# EAGLE design usb2lds_v1.0 (EAGLE 6.5.0)
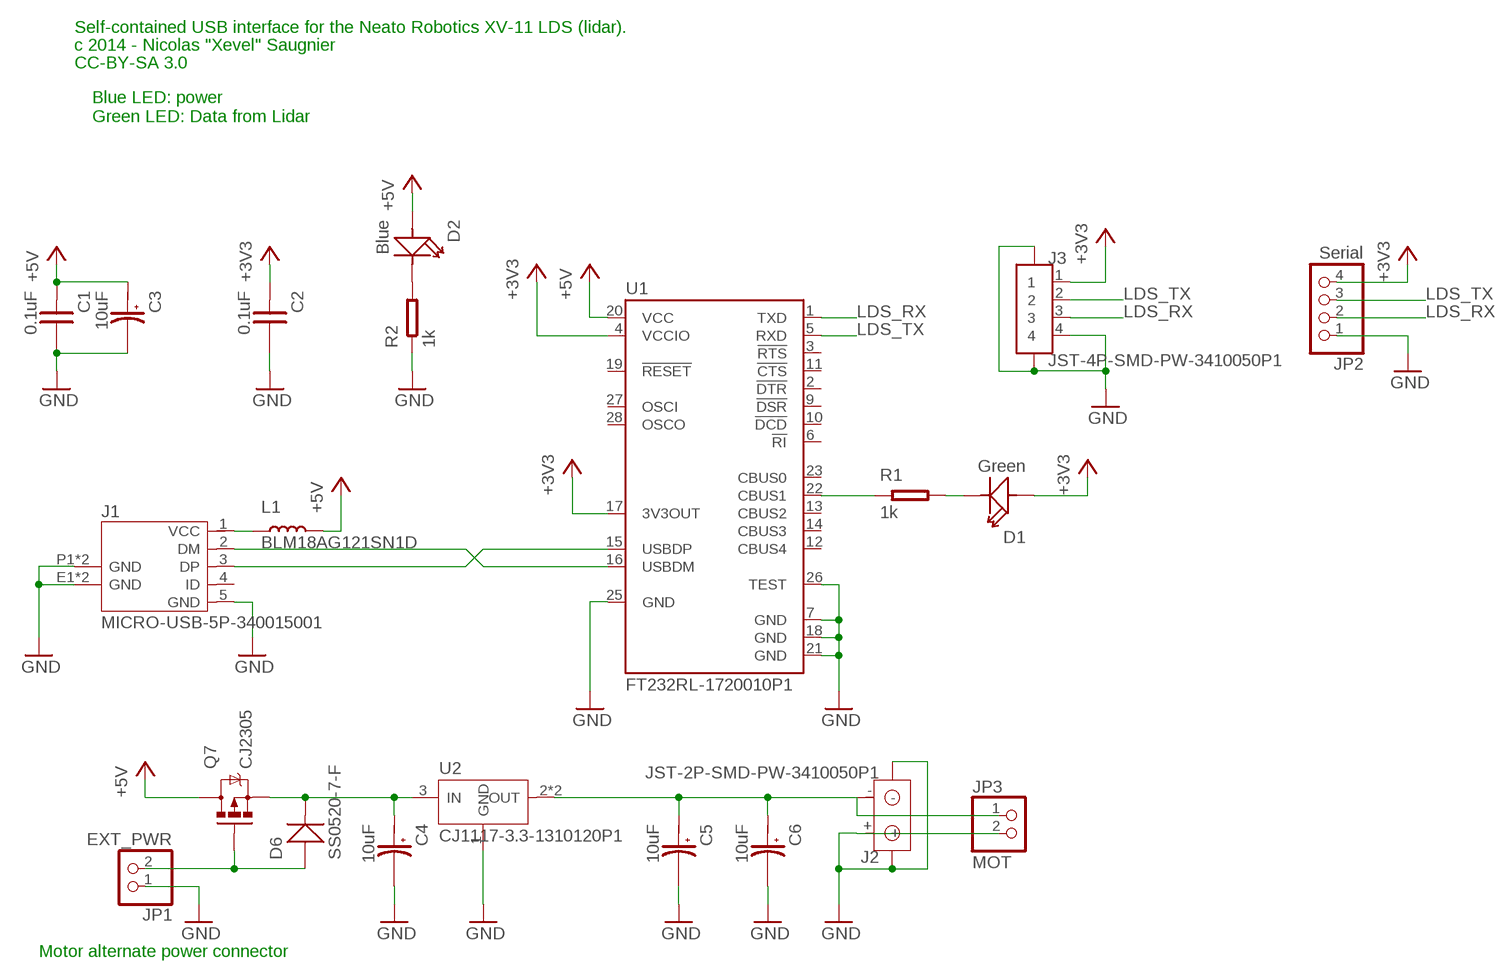
[diagram p0: schematic, sheet 1]

## Parts
C1  0.1uF  C-0603  [C0603]
C2  0.1uF  C-0603  [C0603]
C3  10uF  C-POLAR-A  [AVX-A]
C4  10uF  C-POLAR-A  [AVX-A]
C5  10uF  C-POLAR-A  [AVX-A]
C6  10uF  C-POLAR-A  [AVX-A]
D1  Green  LED  [LED0603]
D2  Blue  LED  [LED0603]
D6  SS0520-7-F  D-SOD-123  [SOD123]
J1  MICRO-USB-5P-340015001  [B-SMD-5P]
J2  JST-2P-SMD-PW-3410050P1  [2P-SMD-2.0-90D]
J3  JST-4P-SMD-PW-3410050P1  [CON-4P-SMD-2.0-90D]
JP1  EXT_PWR  PINHD-1X2  [1X02]
JP2  Serial  PINHD-1X4  [1X04]
JP3  MOT  PINHD-1X2  [1X02]
L1  BLM18AG121SN1D  L-0603  [L0603]
Q7  CJ2305  MOSFET_P_FDN308P  [SOT-23-3_N/SSOT-3_N]
R1  1k  R-0603  [R0603]
R2  1k  R-0603  [R0603]
U1  FT232RL-1720010P1  [SSOP28]
U2  CJ1117-3.3-1310120P1  [SOT89]

## Nets
+3V3: C2.1 D1.+ J3.1 JP2.4 U1.4(VCCIO) U1.17(3V3OUT)
+5V: C1.1 C3.+ D2.+ L1.2 Q7.3(D) U1.20(VCC)
GND: C1.2 C2.2 C3.- C4.- C5.- C6.- J1.5(GND) J1.E1(GND) J1.E2(GND) J1.P1(GND) J1.P2(GND) J2.3 J2.4 J2.+ J3.4 J3.5 J3.6 JP1.1 JP2.1 JP3.2 R2.1 U1.7(GND) U1.18(GND) U1.21(GND) U1.25(GND) U1.26(TEST) U2.1(GND)
LDS_RX: J3.3 JP2.2 U1.1(TXD)
LDS_TX: J3.2 JP2.3 U1.5(RXD)
N$1: J1.2(DM) U1.16(USBDM)
N$2: J1.3(DP) U1.15(USBDP)
N$3: J1.1(VCC) L1.1
N$6: D1.- R1.2
N$7: D2.- R2.2
N$8: R1.1 U1.22(CBUS1)
N$9: C5.+ C6.+ J2.- JP3.1 U2.2(OUT) U2.4(OUT)
N$11: C4.+ D6.- Q7.2(S) U2.3(IN)
VUSB: D6.+ JP1.2 Q7.1(G)
Unconnected: J1.4(ID) U1.2(!DTR) U1.3(!RTS) U1.6(!RI) U1.9(!DSR) U1.10(!DCD) U1.11(!CTS) U1.12(CBUS4) U1.13(CBUS2) U1.14(CBUS3) U1.19(!RESET) U1.23(CBUS0) U1.27(OSCI) U1.28(OSCO)

## Notes on the sheet
- Self-contained USB interface for the Neato Robotics XV-11 LDS (lidar).
- c 2014 - Nicolas "Xevel" Saugnier
- CC-BY-SA 3.0
- Blue LED: power
  Green LED: Data from Lidar
- Motor alternate power connector

## Library data of the parts
C1 C2 = OPL:C*
C3-C6 = OPL:C-POLAR*
D1 D2 = OPL:LED*: LED
D6 = OPL:D*: DIODE
J1 = OPL:MICRO-USB-5P: ST-USB-001E：MICRO USB B SMD R/A
J2 = OPL:JST-2P-SMD-PW
J3 = Xevelabs:JST-4P-SMD-PW
JP1 JP3 = pinhead:PINHD-1X2: PIN HEADER
JP2 = pinhead:PINHD-1X4: PIN HEADER
L1 = OPL:L*
Q7 = Xevelabs:MOSFET_P
R1 R2 = OPL:R*
U1 = OPL:FT232RL: USB UART IC Source: http://www.ftdichip.com/Documents/DataSheets/DS_FT232R_v104.pdf
U2 = OPL:CJ1117-3.3: 1A Low Dropout Linear Regulator

## Board
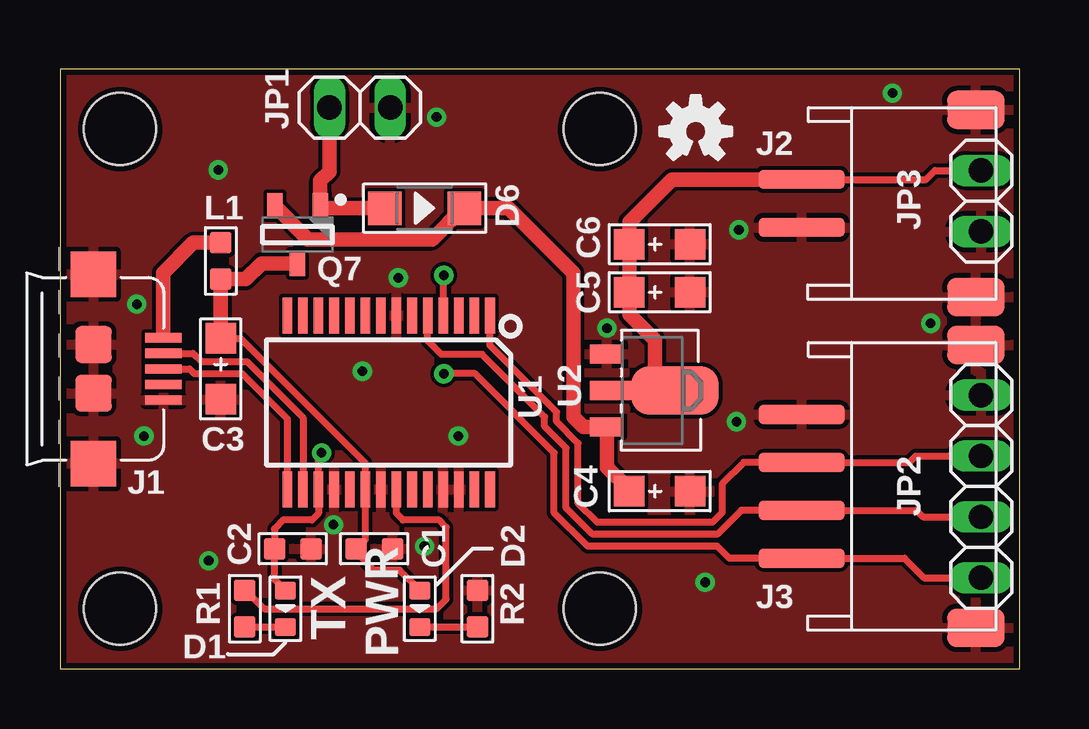
[diagram p1: board, top side]
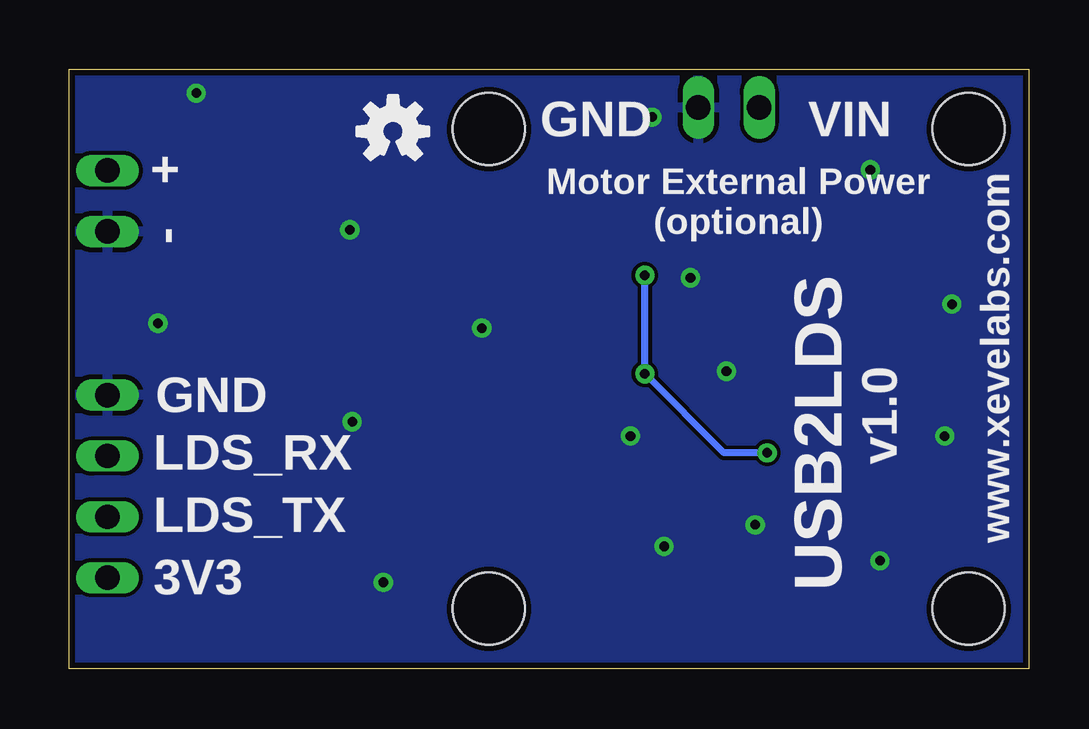
[diagram p2: board, bottom side, seen from below]

Size 40 x 25 mm. Coordinates in mm from the lower left corner, seen from the top.
Outline: 0,0 40,0 40,25 0,25 0,0
Copper layers (1*16): Top 0.035mm / dielectric 1.55mm / Bottom 0.035mm
Design rules "Xevelabs_6mil_eurocircuits": minimum track width 0.15mm, minimum drill 0.25mm, track to track 0.155mm, track to pad 0.155mm, pad to pad 0.155mm, via to via 0.155mm, smd to smd 0mil, copper to edge 0.25mm, drill to drill 0.25mm, minimum pad ring 0mil, minimum via ring 0.2mm, stop-mask expansion 0mil, vias tented up to drill 100mil, thermal gap 0.2mm
Holes 3 mm at 2.5,2.5 2.5,22.5 22.5,22.5 22.5,2.5

### Footprints (pad centres in the part's own frame; a part is rotated, then mirrored left to right if it is on the bottom)
C0603 = smd 0.889 x 0.889: 1 -0.762,0; 2 0.762,0
AVX-A = smd 1.27 x 1.27: + -1.27,0; - 1.27,0
LED0603 = smd 0.762 x 0.889: + -0.762,0; - 0.762,0
SOD123 = smd 1.397 x 1.397: + -1.651,0; - 1.651,0
B-SMD-5P = smd 0.38 x 1.52: 1 -1.3,2.921; 2 -0.65,2.921; 3 0,2.921; 4 0.65,2.921; 5 1.3,2.921 | smd 1.524 x 1.524: E1 -1.016,0; E2 1.016,0 | smd 1.9 x 1.9: P1 -3.95,0; P2 3.95,0
2P-SMD-2.0-90D = smd 1.6 x 2.4: 3 3.9,-2.181; 4 -3.9,-2.181 | smd 0.8 x 3.6: + -1,5.08; - 1,5.08
CON-4P-SMD-2.0-90D = smd 0.8 x 3.6: 1 -3,5.08; 2 -1,5.08; 3 1,5.08; 4 3,5.08 | smd 1.6 x 2.4: 5 -5.9,-2.181; 6 5.9,-2.181
1X02 = drill 1.016 long: 1 -1.27,0; 2 1.27,0
1X04 = drill 1.016 long: 1 -3.81,0; 2 -1.27,0; 3 1.27,0; 4 3.81,0
L0603 = smd 0.889 x 0.889: 1 -0.762,0; 2 0.762,0
SOT-23-3_N/SSOT-3_N = smd 1.05 x 0.65: 1 -1.2,0.95; 2 -1.2,-0.95; 3 1.2,0
R0603 = smd 0.889 x 0.889: 1 -0.762,0; 2 0.762,0
SSOP28 = smd 1.5 x 0.4: 1 -3.625,4.225; 2 -3.625,3.575; 3 -3.625,2.925; 4 -3.625,2.275; 5 -3.625,1.625; 6 -3.625,0.975; 7 -3.625,0.325; 8 -3.625,-0.325; 9 -3.625,-0.975; 10 -3.625,-1.625; 11 -3.625,-2.275; 12 -3.625,-2.925; 13 -3.625,-3.575; 14 -3.625,-4.225; 15 3.625,-4.225; 16 3.625,-3.575; 17 3.625,-2.925; 18 3.625,-2.275; 19 3.625,-1.625; 20 3.625,-0.975; 21 3.625,-0.325; 22 3.625,0.325; 23 3.625,0.975; 24 3.625,1.625; 25 3.625,2.275; 26 3.625,2.925; 27 3.625,3.575; 28 3.625,4.225
SOT89 = smd 0.8 x 1.4: 1 -1.524,-1.905; 3 1.524,-1.905 | smd 0.8 x 1.9: 2 0,-1.651 | smd 2.032 x 3.65: 4 0,0.94

### Placement (x,y rotation side)
C1  13.1,5 0 top
C2  9.7,5 0 top
C3  6.7,12.5 270 top
C4  25,7.4 0 top
C5  25,15.7 0 top
C6  25,17.7 0 top
D1  9.4,2.5 270 top
D2  15,2.5 270 top
D6  15.2,19.2 0 top
J1  1.4,12.5 270 top
J2  36,19.4 90 top
J3  36,7.6 90 top
JP1  12.5,23.4 180 top
JP2  38.4,7.6 270 top
JP3  38.4,19.5 270 top
L1  6.7,17 270 top
Q7  9.9,18.1 270 top
R1  7.7,2.5 270 top
R2  17.4,2.5 270 top
U1  13.7,11.1 270 top
U2  24.7,11.6 270 top
U$1  [OSHW-LOGO-S]  26.5,22.4 0 top
U$2  [OSHW-LOGO-S]  26.5,22.4 0 bottom

### Tracks (layer width: path | path; a pad name or v marks a point on that pad's centre or on a via)
+3V3  (via drill 0.4)
  Top 0.3: JP2.4 36.01,3.79 35.2,4.6 J3.1 27.9,4.6 27.4,5.1 22,5.1 20.6,6.5 20.6,9 17.3,12.3 v16,12.3 | v16,16.4 15.97,16.38 U1.4 | v10.9,9 10.78,8.88 U1.17 10.78,6.47 10.5,6.2 9.3,6.2 8.94,5.84 C2.1 8.94,3.72 D1.+
  Bottom 0.3: v16,16.4 v16,12.3 12.7,9 v10.9,9
+5V
  Top 0.3: C3.+ 7.53,13.77 12.72,8.57 U1.20 12.72,5.39 C1.1 12.34,4.86 13.1,4.1 14.16,4.1 D2.+
  Top 0.6: C3.+ L1.2 7.74,16.24 8.4,16.9 Q7.3
GND  (via drill 0.4)
  other vias: 6.6,20.8 3.5,9.7 3.2,15.2 15.7,23 12.6,12.4 16.6,9.7 6.2,4.5 26.9,3.6 28.2,10.3 28.3,18.3 36.3,14.4 34.7,24 22.8,14.2 14.1,16.3 11.4,6 15.2,5.1
  pour Bottom: -0.6,25.7 42,26.1 43.1,-1.8 -0.7,-0.8 -0.7,25.7
  pour Top: -1.3,25.9 43.1,27.7 41.9,-1.1 -1.3,-0.6
LDS_RX
  Top 0.3: JP2.2 35.67,8.87 35.4,8.6 J3.3 28.5,8.6 27.6,7.7 27.6,6.5 27.2,6.1 22.4,6.1 21.6,6.9 21.6,9.4 20.7,10.3 20.7,10.7 17.93,13.47 U1.1
LDS_TX
  Top 0.3: JP2.3 35.97,6.33 35.7,6.6 J3.2 28.4,6.6 27.4,5.6 22.2,5.6 21.1,6.7 21.1,9.2 20.2,10.1 20.2,10.5 17.6,13.1 15.9,13.1 15.32,13.68 U1.5
N$1
  Top 0.3: J1.2 5.55,13.15 5.9,12.8 7.8,12.8 10.12,10.47 U1.16
N$2
  Top 0.3: J1.3 5.4,12.5 5.6,12.3 7.6,12.3 9.47,10.43 U1.15
N$3
  Top 0.3: 4.3,14 4.32,13.98 J1.1
  Top 0.6: 4.3,14 4.3,16.5 5.56,17.76 L1.1
N$6
  Top 0.3: R1.2 D1.-
N$7
  Top 0.3: D2.- R2.2
N$8
  Top 0.3: R1.1 7.74,3.26 8.5,2.5 15.7,2.5 16.1,2.9 16.1,5.9 15.8,6.2 14.3,6.2 14.03,6.47 U1.22
N$9
  Top 0.3: J2.- 36.1,20.4 36.47,20.77 JP3.1
  Top 0.6: J2.- 25.5,20.4 23.73,18.63 C6.+ C5.+ 23.73,14.77 24.8,13.7 24.8,11.6 | U2.2 24.8,11.6 | 24.8,11.6 U2.4
N$11
  Top 0.6: C4.+ 23.73,7.47 22.8,8.4 U2.3 21.82,10.08 21.4,10.5 21.4,16.5 18.7,19.2 D6.- 16.8,19.2 15.5,17.9 10.35,17.9 Q7.2
VUSB
  Top 0.6: JP1.2 11.23,20.73 10.85,20.35 Q7.1 10.95,19.2 D6.+

### Text on the board
tPlace: TX | PWR
bNames: GND | VIN | www.xevelabs.com | Motor External Power / (optional) | + | - | USB2LDS | v1.0 | GND | LDS_RX | LDS_TX | 3V3